# EAGLE design ds1307 (EAGLE 6.3)
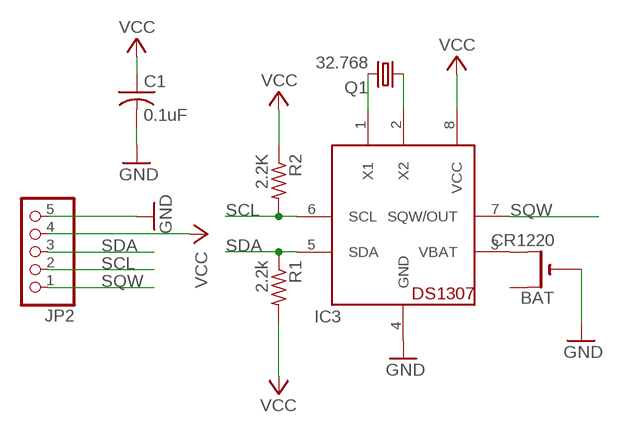
[diagram p0: schematic, sheet 1]

## Parts
BAT  CR1220  CR1220THM  [CR1220-THM]
C1  0.1uF  C-US025-025X050  [C025-025X050]
IC3  DS1307  [DIL08]
JP2  PINHD-1X5  [1X05]
Q1  32.768  CRYTALTC38H  [TC38H]
R1  2.2k  R-US_0207/10  [0207/10]
R2  2.2K  R-US_0207/10  [0207/10]

## Nets
GND: BAT.- C1.2 IC3.4(GND) JP2.5
N$14: IC3.1(X1) Q1.2
N$15: IC3.2(X2) Q1.1
N$39: BAT.+2(+1) IC3.3(VBAT)
SCL: IC3.6(SCL) JP2.2 R2.2
SDA: IC3.5(SDA) JP2.3 R1.1
SQW: IC3.7(SQW/OUT) JP2.1
VCC: C1.1 IC3.8(VCC) JP2.4 R1.2 R2.1
Unconnected: BAT.+1(+)

## Library data of the parts
BAT = adafruit:CR1220: CR1216/CR1220/CR1225 12mm 3V lithium coin cell Great for battery packup. Both SMT and THM holders. Note the THM package has the ground pads on both sides of the PCB so that the masks are the same - this reduces the cost
C1 = adafruit:C-US: CAPACITOR, American symbol
IC3 = adafruit:DS1307: DS1307 Real time clock (RTC) with battery backup ability. Talk to it via i2c
JP2 = pinhead:PINHD-1X5: PIN HEADER
Q1 = crystal:CRYTAL: CRYSTAL
R1 R2 = adafruit:R-US_: RESISTOR, American symbol

## Board
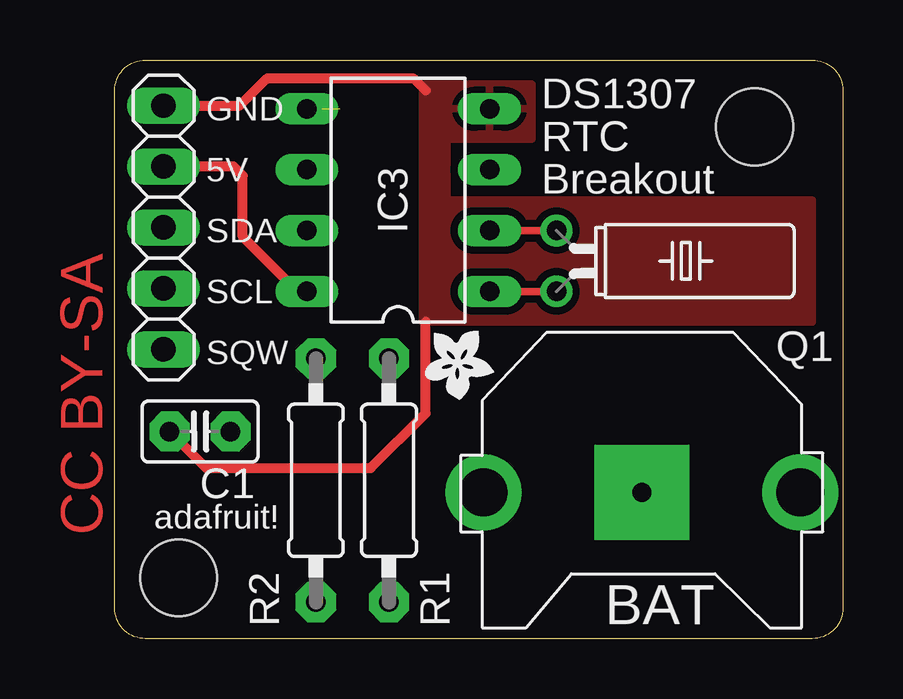
[diagram p1: board, top side]
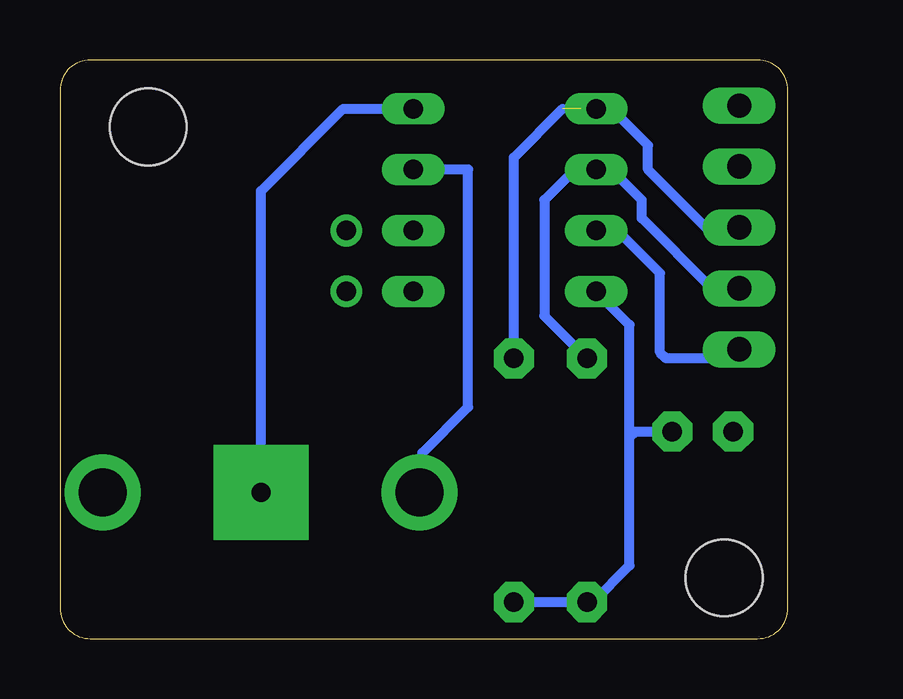
[diagram p2: board, bottom side, seen from below]

Size 30.35 x 24.13 mm. Coordinates in mm from the lower left corner, seen from the top.
Outline: 0,22.86 arc-90 1.27,24.13 29.08,24.13 arc-90 30.35,22.86 30.35,1.27 arc-90 29.08,0 1.27,0 arc-90 0,1.27 0,22.86
Copper layers (1*16): Top 0.035mm / dielectric 1.5mm / Bottom 0.035mm
Design rules "default *": minimum track width 10mil, minimum drill 20mil, track to track 12mil, track to pad 12mil, pad to pad 10mil, via to via 12mil, smd to smd 0mil, copper to edge 20mil, drill to drill 8mil, minimum pad ring 10mil, minimum via ring 8mil, stop-mask expansion 4mil, vias tented up to drill 20mil, thermal gap 10mil
Holes 3.2 mm at 26.67,21.34 2.67,2.54

### Footprints (pad centres in the part's own frame; a part is rotated, then mirrored left to right if it is on the bottom)
CR1220-THM = drill 2 pad 3.175: +1 -6.604,0; +2 6.604,0 | drill 0.8 pad 3.962 square: - 0,0
C025-025X050 = drill 0.813 pad 1.676 octagon: 1 -1.27,0; 2 1.27,0
DIL08 = drill 0.813 long: 1 -3.81,-3.81; 2 -1.27,-3.81; 3 1.27,-3.81; 4 3.81,-3.81; 5 3.81,3.81; 6 1.27,3.81; 7 -1.27,3.81; 8 -3.81,3.81
1X05 = drill 1.016 long: 1 -5.08,0; 2 -2.54,0; 3 0,0; 4 2.54,0; 5 5.08,0
TC38H = drill 0.813: 1 -1.27,0; 2 1.27,0
0207/10 = drill 0.813 pad 1.676 octagon: 1 -5.08,0; 2 5.08,0

### Placement (x,y rotation side)
BAT  21.97,6.1 180 top
C1  3.56,8.64 180 top
IC3  11.81,18.29 90 top
JP2  2.03,17.14 90 top
Q1  18.41,15.75 270 top
R1  11.43,6.6 270 top
R2  8.38,6.6 90 top
U$1  [ADAFRUIT200MIL]  14.48,11.43 180 top

### Tracks (layer width: path | path; a pad name or v marks a point on that pad's centre or on a via)
GND
  Top 0.406: IC3.4 15.49,22.1 | JP2.5 5.21,22.23 6.35,23.37 12.45,23.37 12.95,22.86 | C1.2 3.81,7.11 10.67,7.11 12.95,9.4 12.95,13.21
  Bottom 0.406: BAT.- 21.97,18.67 18.54,22.1 IC3.4
  pour Top: 12.83,23.11 12.83,13.21 29.08,13.21 29.08,18.29 13.84,18.29 13.84,20.83 17.4,20.83 17.4,23.11
N$14
  Top 0.305: IC3.1 15.88,14.48 arc-90 16,14.35 arc-90 16.13,14.48 Q1.2
N$15
  Top 0.305: IC3.2 Q1.1
N$39
  Bottom 0.406: IC3.3 13.34,19.56 13.34,9.65 15.24,7.75 15.24,6.1 BAT.+2
SCL
  Bottom 0.406: R2.2 10.16,13.46 10.16,18.29 8.89,19.56 IC3.6 | IC3.6 7.87,19.56 | JP2.2 3.17,14.61 6.1,17.53 6.1,18.29 7.11,19.3 7.62,19.3 8,19.68 | 8,19.68 8.13,19.81 | 8,19.68 IC3.6
SDA  (1 unrouted)
  Bottom 0.406: R1.1 11.43,20.07 9.4,22.1 | JP2.3 3.43,17.14 5.84,19.56 5.84,20.57 7.37,22.1 IC3.5 8.64,22.1
SQW
  Bottom 0.406: IC3.7 7.11,17.02 5.33,15.24 5.33,11.94 5.08,11.68 2.54,11.68 2.29,11.94 1.91,11.94 | 1.78,11.94 1.91,11.94 | 1.91,11.94 JP2.1
VCC
  Top 0.406: JP2.4 4.95,19.68 5.33,19.3 5.33,16.76 7.62,14.48 IC3.8
  Bottom 0.406: IC3.8 6.6,13.08 6.6,8.38 | 6.6,8.38 6.6,3.05 8.13,1.52 R2.1 R1.2 | C1.1 6.35,8.64 6.6,8.38

### Text on the board
Top: CC BY-SA
tPlace: GND | DS1307 | RTC | 5V | Breakout | SDA | SCL | SQW | adafruit!